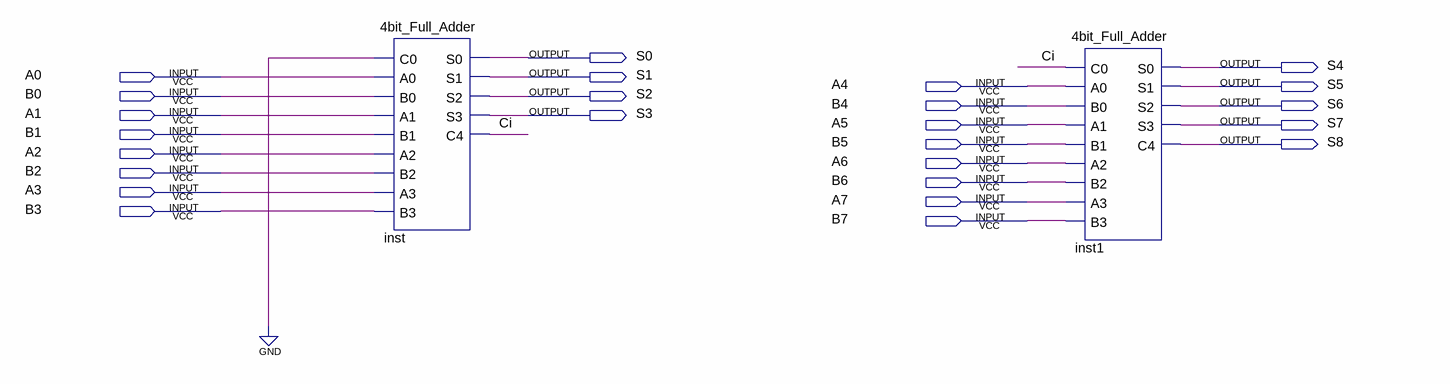
[diagram p0: schematic sheet]
// Quartus schematic 8bit_Adder.bdf as structural Verilog: 2 symbols, 25 pins
module \8bit_Adder  (
  input  A0,
  input  A4,
  input  B0,
  input  B4,
  input  A1,
  input  A5,
  input  B1,
  input  B5,
  input  A2,
  input  A6,
  input  B2,
  input  B6,
  input  A3,
  input  A7,
  input  B3,
  input  B7,
  output S0,
  output S4,
  output S1,
  output S5,
  output S2,
  output S6,
  output S3,
  output S7,
  output S8
);

  wire Ci;

  \4bit_Full_Adder  inst (
    .C0(1'b0), .A0(A0), .B0(B0), .A1(A1), .B1(B1), .A2(A2), .B2(B2), .A3(A3), .B3(B3), .S0(S0), .S1(S1),
    .S2(S2), .S3(S3), .C4(Ci));
  \4bit_Full_Adder  inst1 (
    .C0(Ci), .A0(A4), .B0(B4), .A1(A5), .B1(B5), .A2(A6), .B2(B6), .A3(A7), .B3(B7), .S0(S4), .S1(S5),
    .S2(S6), .S3(S7), .C4(S8));
endmodule
